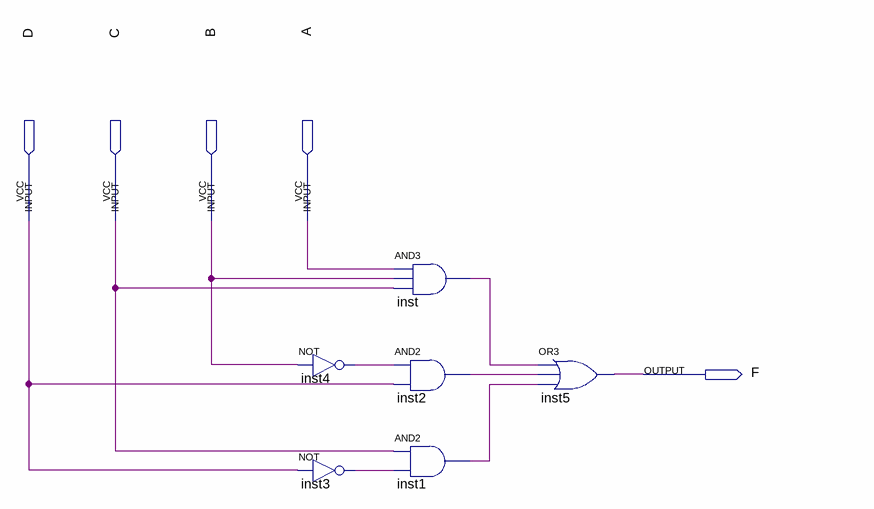
[diagram p0: schematic sheet]
// Quartus schematic Test.bdf as structural Verilog: 6 symbols, 5 pins
module Test (
  input  D,
  input  C,
  input  B,
  input  A,
  output F
);

  wire inst1_out, inst2_out, inst3_out, inst4_out, inst_out;

  not inst4 (inst4_out, B);
  not inst3 (inst3_out, D);
  and inst (inst_out, A, B, C);
  and inst2 (inst2_out, inst4_out, D);
  and inst1 (inst1_out, C, inst3_out);
  or inst5 (F, inst_out, inst2_out, inst1_out);
endmodule
